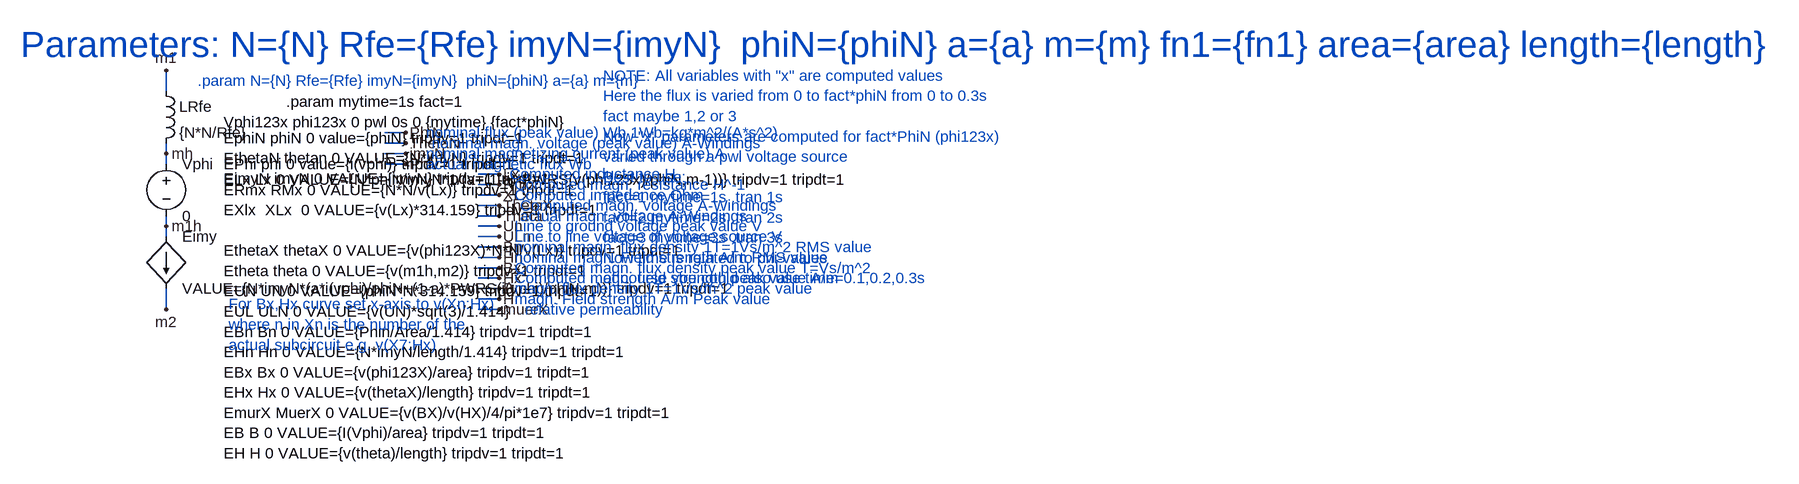
[diagram p0: schematic schenkel.asc]
schenkel.asc, the LTspice schematic file:
Version 4.1
SHEET 1 1112 680
WIRE 192 96 192 64
WIRE 560 160 528 160
WIRE 560 176 528 176
WIRE 192 192 192 176
WIRE 560 192 528 192
WIRE 192 208 192 192
WIRE 560 208 528 208
WIRE 704 224 672 224
WIRE 704 240 672 240
WIRE 704 256 672 256
WIRE 704 272 672 272
WIRE 704 288 672 288
WIRE 192 304 192 288
WIRE 704 304 672 304
WIRE 192 320 192 304
WIRE 704 320 672 320
WIRE 704 336 672 336
WIRE 704 352 672 352
WIRE 704 368 672 368
WIRE 704 384 672 384
WIRE 704 400 672 400
WIRE 704 416 672 416
WIRE 192 432 192 400
WIRE 704 432 672 432
FLAG 192 64 m1
FLAG 192 432 m2
FLAG 192 304 m1h
FLAG 192 192 mh
FLAG 560 160 PhiN
FLAG 704 240 RmX
FLAG 704 224 Lx
FLAG 704 256 XLx
FLAG 704 272 ThetaX
FLAG 560 176 ThetaN
FLAG 704 304 Un
FLAG 704 336 Bn
FLAG 704 352 Hn
FLAG 704 288 Theta
FLAG 560 208 Phi
FLAG 704 320 ULn
FLAG 704 368 Bx
FLAG 704 384 Hx
FLAG 560 192 imyN
FLAG 704 400 B
FLAG 704 416 H
FLAG 704 432 muerX
SYMBOL ind 176 80 R0
SYMATTR InstName LRfe
SYMATTR Value {N*N/Rfe}
SYMATTR SpiceLine Rser=0
SYMBOL voltage 192 192 R0
SYMATTR InstName Vphi
SYMATTR Value 0
SYMBOL f 192 320 R0
SYMATTR InstName Eimy
SYMATTR Value VALUE={N*imyN*(a*i(vphi)/phiN+(1-a)*PWRS(i(vphi)/phiN,m))} tripdv=1 tripdt=1
SYMATTR Prefix E
TEXT -32 24 Left 5 ;Parameters: N={N} Rfe={Rfe} imyN={imyN}  phiN={phiN} a={a} m={m} fn1={fn1} area={area} length={length}
TEXT 240 80 Left 2 ;.param N={N} Rfe={Rfe} imyN={imyN}  phiN={phiN} a={a} m={m}
TEXT 280 168 Left 2 !EphiN phiN 0 value={phiN} tripdv=1 tripdt=1\nEthetaN thetan 0 VALUE={N*imyN} tripdv=1 tripdt=1\nEimyN imyN 0 VALUE={imyN} tripdv=1 tripdt=1
TEXT 280 208 Left 2 !EPhi phi 0 value={i(vphi)} tripdv=1 tripdt=1
TEXT 280 232 Left 2 !ELx Lx 0 VALUE={N*phiN/imyN*1/(a+(1-a)*PWRS(v(phi123x)/phiN,m-1))} tripdv=1 tripdt=1
TEXT 280 248 Left 2 !ERmx RMx 0 VALUE={N*N/v(Lx)} tripdv=1 tripdt=1\nEXlx  XLx  0 VALUE={v(Lx)*314.159} tripdv=1 tripdt=1\n \nEthetaX thetaX 0 VALUE={v(phi123X)*N*N/v(Lx)} tripdv=1 tripdt=1\nEtheta theta 0 VALUE={v(m1h,m2)} tripdv=1 tripdt=1\nEUN UN 0 VALUE={phiN*N*314.159} tripdv=1 tripdt=1\nEUL ULN 0 VALUE={v(UN)*sqrt(3)/1.414}\nEBn Bn 0 VALUE={Phin/Area/1.414} tripdv=1 tripdt=1\nEHn Hn 0 VALUE={N*imyN/length/1.414} tripdv=1 tripdt=1\nEBx Bx 0 VALUE={v(phi123X)/area} tripdv=1 tripdt=1\nEHx Hx 0 VALUE={v(thetaX)/length} tripdv=1 tripdt=1\nEmurX MuerX 0 VALUE={v(BX)/v(HX)/4/pi*1e7} tripdv=1 tripdt=1\nEB B 0 VALUE={I(Vphi)/area} tripdv=1 tripdt=1\nEH H 0 VALUE={v(theta)/length} tripdv=1 tripdt=1
TEXT 280 144 Left 2 !Vphi123x phi123x 0 pwl 0s 0 {mytime} {fact*phiN}
TEXT 376 112 Left 2 !.param mytime=1s fact=1
TEXT 288 424 Left 2 ;For Bx,Hx curve set x-axis to v(Xn:Hx) \nwhere n in Xn is the number of the\nactual subcircuit e.g. v(X7:Hx)
TEXT 592 160 Left 2 ;nominal flux (peak value) Wb 1Wb=kg*m^2/(A*s^2)
TEXT 600 176 Left 2 ;nominal magn. voltage (peak value) A-Windings
TEXT 592 192 Left 2 ;nominal magnetizing current (peak value) A
TEXT 592 208 Left 2 ;actual magnetic flux Wb
TEXT 720 224 Left 2 ;Computed inductance H
TEXT 728 240 Left 2 ;Computed magn. resistance H^-1
TEXT 728 256 Left 2 ;Computed impedance Ohm
TEXT 736 272 Left 2 ;Computed magn. voltage A-Windings
TEXT 736 288 Left 2 ;actual magn. voltage A-Windings
TEXT 728 304 Left 2 ;Line to ground voltage peak value V
TEXT 728 320 Left 2 ;Line to line voltage of voltage source V
TEXT 728 336 Left 2 ;nominal magn. flux density 1T=1Vs/m^2 RMS value
TEXT 728 352 Left 2 ;nominal magn. Field strength A/m RMS value
TEXT 728 368 Left 2 ;Computed magn. flux density peak value T=Vs/m^2
TEXT 728 384 Left 2 ;Computed magn. field strength peak value A/m
TEXT 864 72 Left 2 ;NOTE: All variables with "x" are computed values\nHere the flux is varied from 0 to fact*phiN from 0 to 0.3s\nfact maybe 1,2 or 3\nNow "x" parameters are computed for fact*PhiN (phi123x)\nvaried through a pwl voltage source\nBest to use:\nfact=1 mytime=1s .tran 1s\nfact=2 mytime=2s .tran 2s\nfact=3 mytime=3s .tran 3s\nNow time is related to phi-values\nof course you could also use time=0.1,0.2,0.3s
TEXT 728 400 Left 2 ;magn. flux density 1T=1Vs/m^2 peak value
TEXT 728 416 Left 2 ;magn. Field strength A/m Peak value
TEXT 744 432 Left 2 ;relative permeability

The netlist it stands for:
* schenkel.asc
LRfe m1 mh {N*N/Rfe} Rser=0
Vphi mh m1h 0
Eimy m1h m2 VALUE={N*imyN*(a*i(vphi)/phiN+(1-a)*PWRS(i(vphi)/phiN,m))} tripdv=1 tripdt=1
* Parameters: N={N} Rfe={Rfe} imyN={imyN}  phiN={phiN} a={a} m={m} fn1={fn1} area={area} length={length}
* .param N={N} Rfe={Rfe} imyN={imyN}  phiN={phiN} a={a} m={m}
EphiN phiN 0 value={phiN} tripdv=1 tripdt=1
EthetaN thetan 0 VALUE={N*imyN} tripdv=1 tripdt=1
EimyN imyN 0 VALUE={imyN} tripdv=1 tripdt=1
EPhi phi 0 value={i(vphi)} tripdv=1 tripdt=1
ELx Lx 0 VALUE={N*phiN/imyN*1/(a+(1-a)*PWRS(v(phi123x)/phiN,m-1))} tripdv=1 tripdt=1
ERmx RMx 0 VALUE={N*N/v(Lx)} tripdv=1 tripdt=1
EXlx  XLx  0 VALUE={v(Lx)*314.159} tripdv=1 tripdt=1
EthetaX thetaX 0 VALUE={v(phi123X)*N*N/v(Lx)} tripdv=1 tripdt=1
Etheta theta 0 VALUE={v(m1h,m2)} tripdv=1 tripdt=1
EUN UN 0 VALUE={phiN*N*314.159} tripdv=1 tripdt=1
EUL ULN 0 VALUE={v(UN)*sqrt(3)/1.414}
EBn Bn 0 VALUE={Phin/Area/1.414} tripdv=1 tripdt=1
EHn Hn 0 VALUE={N*imyN/length/1.414} tripdv=1 tripdt=1
EBx Bx 0 VALUE={v(phi123X)/area} tripdv=1 tripdt=1
EHx Hx 0 VALUE={v(thetaX)/length} tripdv=1 tripdt=1
EmurX MuerX 0 VALUE={v(BX)/v(HX)/4/pi*1e7} tripdv=1 tripdt=1
EB B 0 VALUE={I(Vphi)/area} tripdv=1 tripdt=1
EH H 0 VALUE={v(theta)/length} tripdv=1 tripdt=1
Vphi123x phi123x 0 pwl 0s 0 {mytime} {fact*phiN}
.param mytime=1s fact=1
* For Bx,Hx curve set x-axis to v(Xn:Hx)
* where n in Xn is the number of the
* actual subcircuit e.g. v(X7:Hx)
* nominal flux (peak value) Wb 1Wb=kg*m^2/(A*s^2)
* nominal magn. voltage (peak value) A-Windings
* nominal magnetizing current (peak value) A
* actual magnetic flux Wb
* Computed inductance H
* Computed magn. resistance H^-1
* Computed impedance Ohm
* Computed magn. voltage A-Windings
* actual magn. voltage A-Windings
* Line to ground voltage peak value V
* Line to line voltage of voltage source V
* nominal magn. flux density 1T=1Vs/m^2 RMS value
* nominal magn. Field strength A/m RMS value
* Computed magn. flux density peak value T=Vs/m^2
* Computed magn. field strength peak value A/m
* NOTE: All variables with "x" are computed values
* Here the flux is varied from 0 to fact*phiN from 0 to 0.3s
* fact maybe 1,2 or 3
* Now "x" parameters are computed for fact*PhiN (phi123x)
* varied through a pwl voltage source
* Best to use:
* fact=1 mytime=1s .tran 1s
* fact=2 mytime=2s .tran 2s
* fact=3 mytime=3s .tran 3s
* Now time is related to phi-values
* of course you could also use time=0.1,0.2,0.3s
* magn. flux density 1T=1Vs/m^2 peak value
* magn. Field strength A/m Peak value
* relative permeability
.backanno
.end